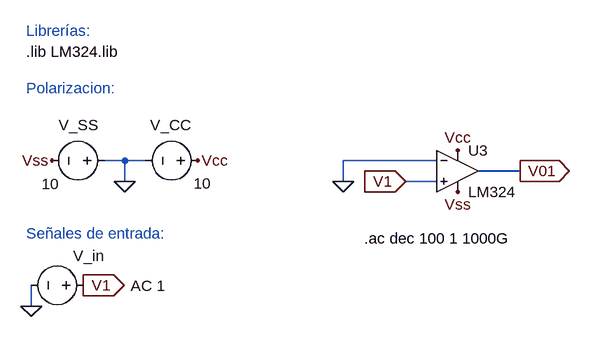
[diagram p0: schematic Respuesta en frecuencia LM324.asc]
Respuesta en frecuencia LM324.asc, the LTspice schematic file:
Version 4
SHEET 1 1652 680
WIRE 32 -256 0 -256
WIRE 64 -256 32 -256
WIRE 512 -256 368 -256
WIRE 640 -240 576 -240
WIRE 32 -224 32 -256
WIRE 368 -224 368 -256
WIRE 512 -224 464 -224
WIRE -112 -32 -112 -64
FLAG 144 -256 Vcc
FLAG -80 -256 Vss
FLAG 32 -224 0
FLAG -112 -32 0
FLAG -32 -64 V1
IOPIN -32 -64 Out
FLAG 544 -272 Vcc
FLAG 544 -208 Vss
FLAG 464 -224 V1
IOPIN 464 -224 In
FLAG 368 -224 0
FLAG 640 -240 V01
IOPIN 640 -240 Out
SYMBOL voltage -16 -64 M270
WINDOW 0 45 31 VLeft 2
WINDOW 3 1 -53 VLeft 2
WINDOW 123 -1 -57 VLeft 2
WINDOW 39 0 0 Left 0
SYMATTR InstName V_in
SYMATTR Value ""
SYMATTR Value2 AC 1
SYMBOL voltage 160 -256 R90
WINDOW 0 -55 25 VRight 2
WINDOW 3 35 -5 VRight 2
WINDOW 123 0 0 Left 0
WINDOW 39 0 0 Left 0
SYMATTR InstName V_CC
SYMATTR Value 10
SYMBOL voltage 16 -256 R90
WINDOW 0 -55 25 VRight 2
WINDOW 3 36 85 VRight 2
WINDOW 123 0 0 Left 0
WINDOW 39 0 0 Left 0
SYMATTR InstName V_SS
SYMATTR Value 10
SYMBOL OpAmps\\opamp2 544 -304 R0
SYMATTR InstName U3
SYMATTR Value LM324
TEXT -120 -424 Left 2 !.lib LM324.lib
TEXT -120 -456 Left 2 ;Librerías:
TEXT -120 -368 Left 2 ;Polarizacion:
TEXT -120 -144 Left 2 ;Señales de entrada:
TEXT 400 -136 Left 2 !.ac dec 100 1 1000G

The netlist it stands for:
* Respuesta en frecuencia LM324.asc
V_in V1 0 AC 1
V_CC Vcc 0 10
V_SS 0 Vss 10
XU3 V1 0 Vcc Vss V01 LM324  ; pins In+ In- V+ V- OUT
.lib LM324.lib
* Librerías:
* Polarizacion:
* Señales de entrada:
.ac dec 100 1 1000G
.backanno
.end

* Results of the author's LTspice run, read from the files saved beside the schematic
* Operating Point, zero values left out:
*   V(vcc) = 10 V
*   V(vss) = -10 V
*   V(v01) = -3.352 V
*   I(V_ss) = -669.8 µA
*   I(V_cc) = -669.9 µA
*   I(V_in) = 19.93 nA
*   Ix(u3:1) = -19.93 nA
*   Ix(u3:2) = -19.93 nA
*   Ix(u3:3) = 669.9 µA
*   Ix(u3:4) = -669.8 µA
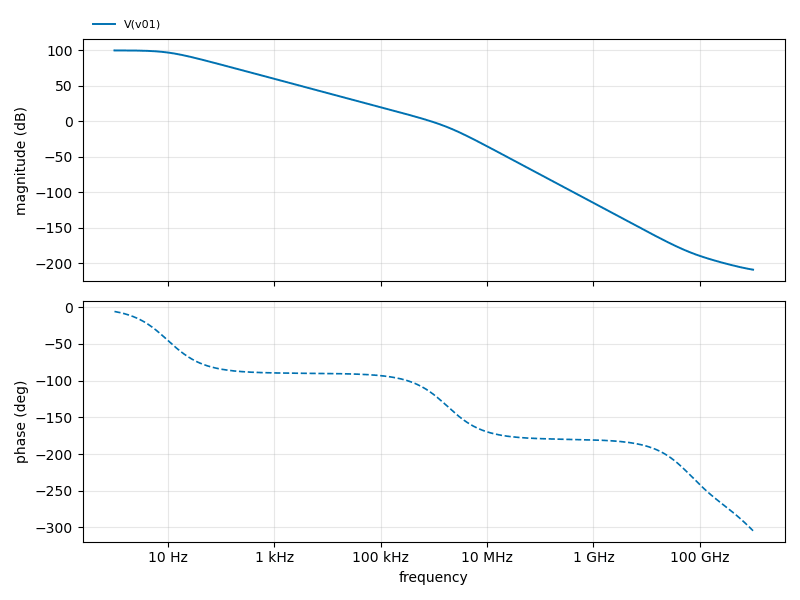
[diagram p1: AC Analysis of Respuesta en frecuencia LM324.asc, plotted from the saved traces]
* AC Analysis, 1 run:
*   V(v01): 99.92 dB at 1 Hz, -208.90 dB at 1 THz, peak 99.92 dB at 1 Hz, 3 dB below the peak at 10.12 Hz